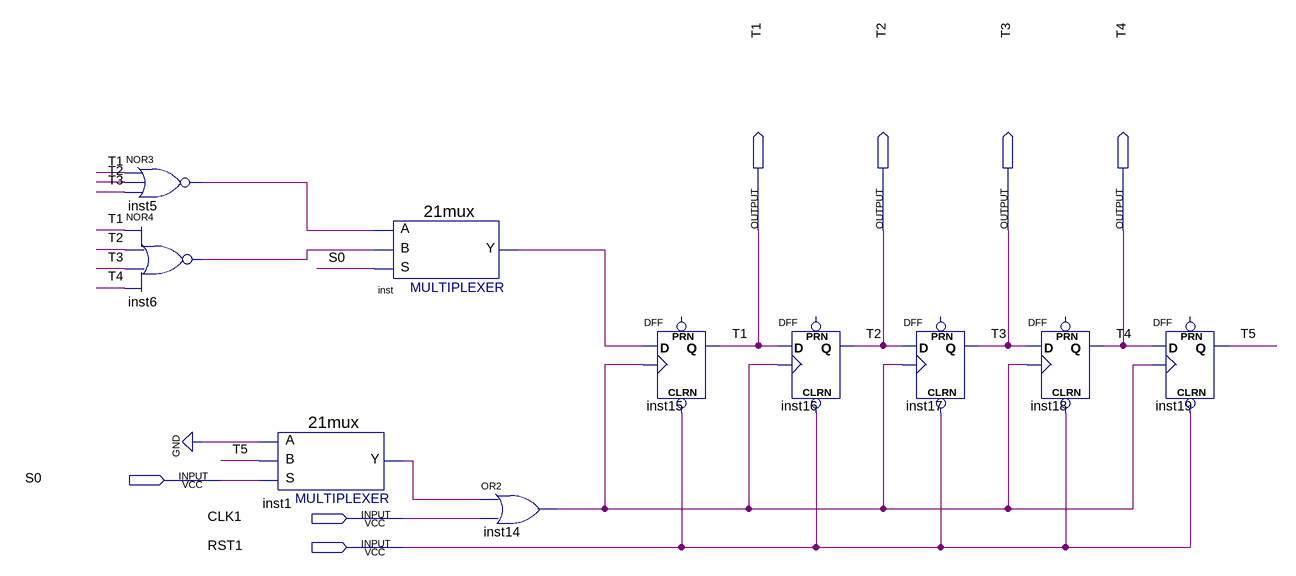
[diagram p0: schematic sheet]
// Quartus schematic STEP.bdf as structural Verilog: 10 symbols, 7 pins
module STEP (
  input  S0,
  input  CLK1,
  input  RST1,
  output T1,
  output T2,
  output T3,
  output T4
);

  wire inst1_y, inst5_out, inst6_out, inst14_out, inst_y, T5;

  nor inst5 (inst5_out, T1, T2, T3);
  nor inst6 (inst6_out, T1, T2, T3, T4);
  \21mux  inst1 (.S(S0), .B(T5), .A(1'b0), .Y(inst1_y));
  \21mux  inst (.S(S0), .B(inst6_out), .A(inst5_out), .Y(inst_y));
  or inst14 (inst14_out, inst1_y, CLK1);
  DFF inst15 (.CLRN(RST1), .CLK(inst14_out), .D(inst_y), .Q(T1));  // open: PRN
  DFF inst16 (.CLRN(RST1), .CLK(inst14_out), .D(T1), .Q(T2));  // open: PRN
  DFF inst17 (.CLRN(RST1), .CLK(inst14_out), .D(T2), .Q(T3));  // open: PRN
  DFF inst18 (.CLRN(RST1), .CLK(inst14_out), .D(T3), .Q(T4));  // open: PRN
  DFF inst19 (.CLRN(RST1), .CLK(inst14_out), .D(T4), .Q(T5));  // open: PRN
endmodule
